# EAGLE board 519_jetson_nano_020100 (EAGLE 9.6.2)
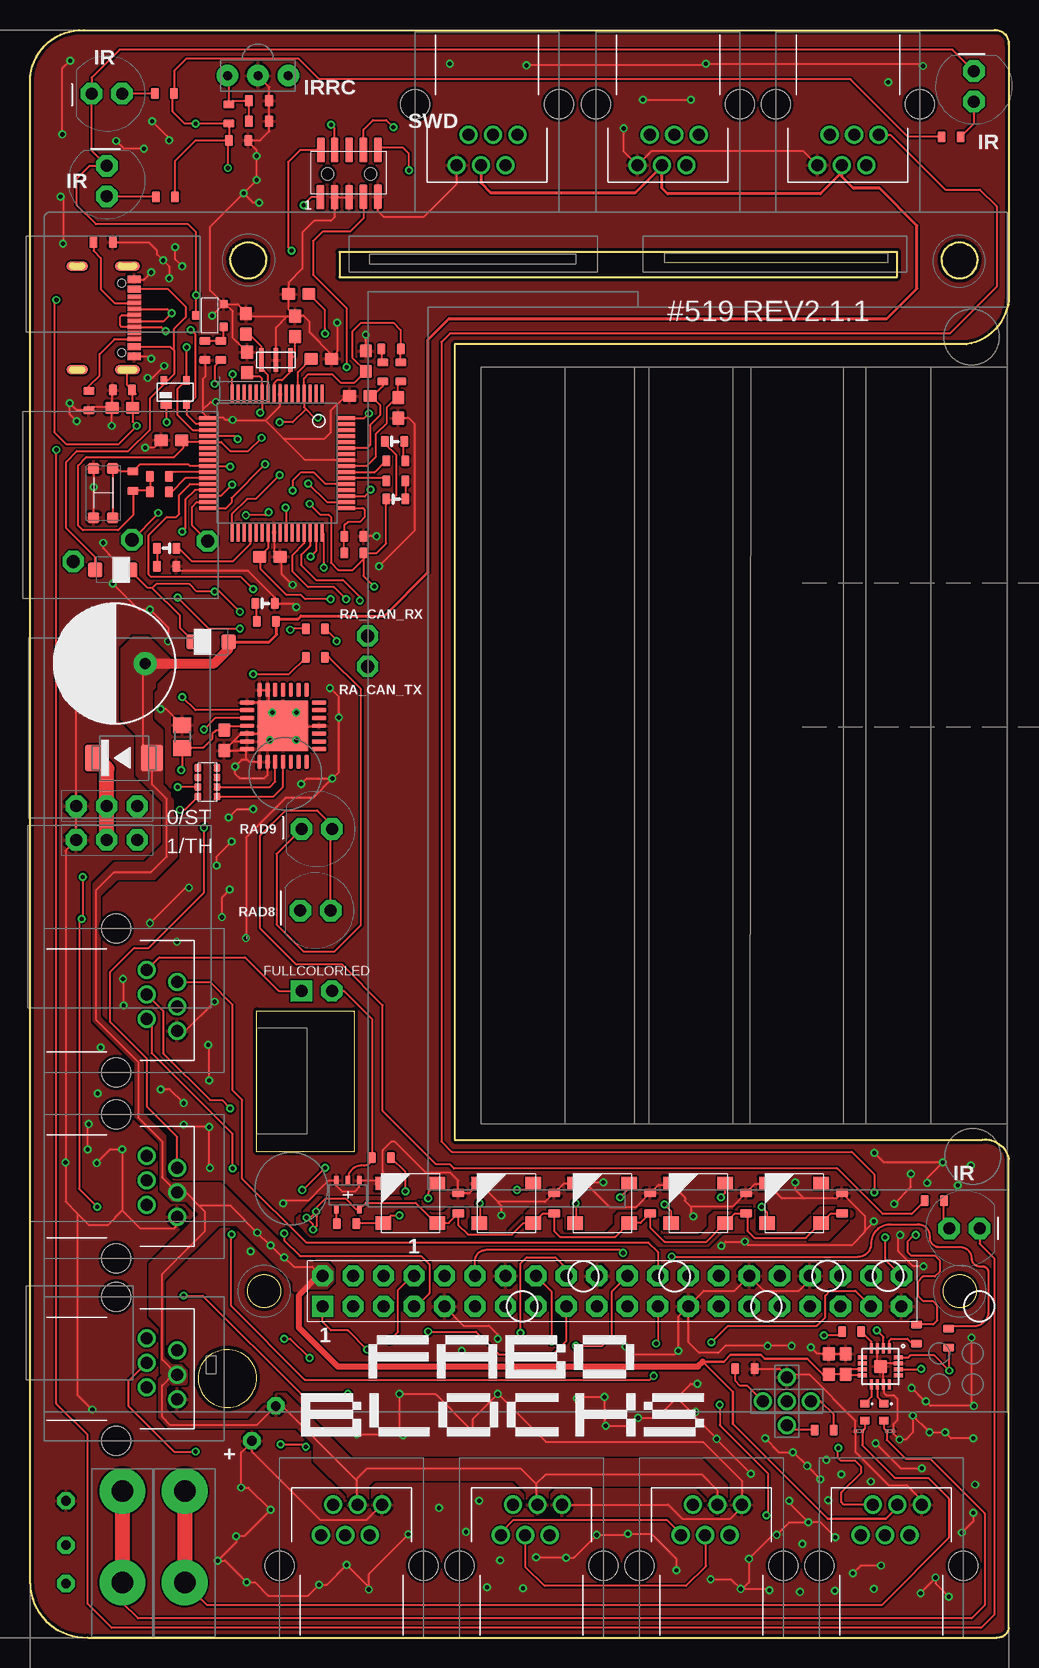
[diagram p5: board, top side]
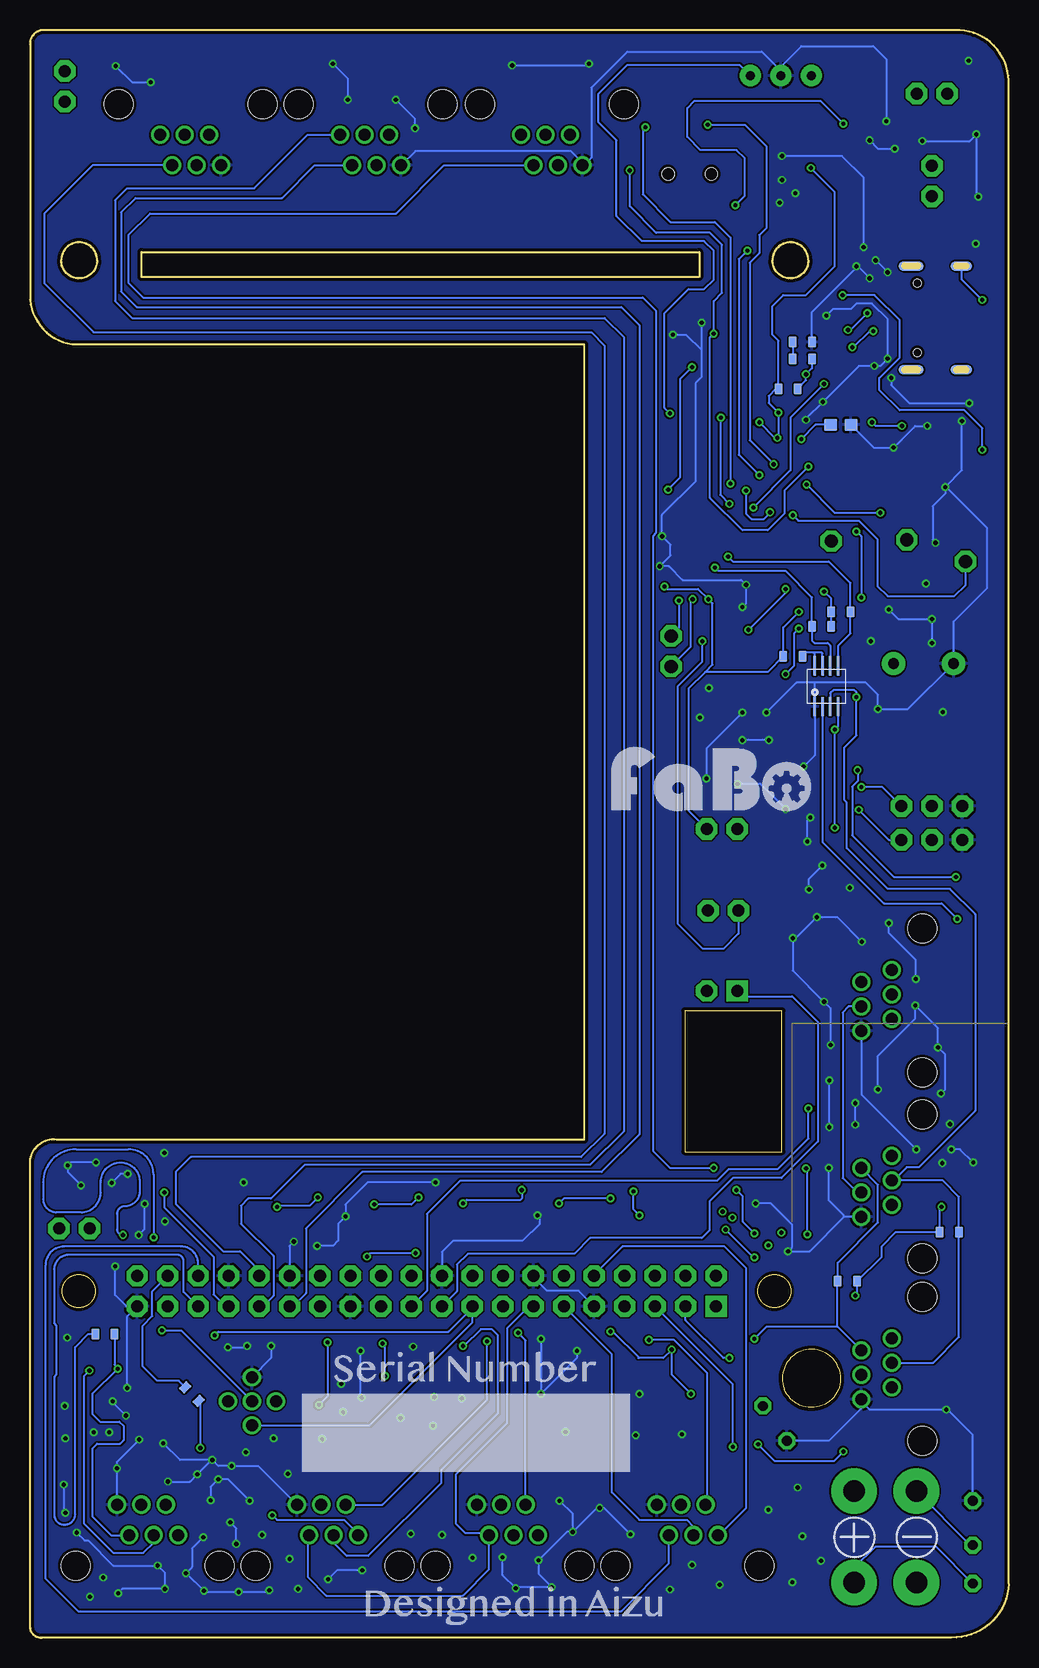
[diagram p6: board, bottom side, seen from below]

Size 81.6 x 134.01 mm. Coordinates in mm from the lower left corner, seen from the top.
Outline: 35.4,41.51 79.4,41.51 arc-84 81.6,39.91 81.6,0.81 arc-90 80.6,0.01 4.8,0.01 arc-90 0,4.51 0,129.81 arc-90 4.5,134.01 80.4,134.01 arc-96 81.6,132.81 81.6,111.51 arc-75 78.1,107.81 35.4,107.81 35.4,41.51
Outline: 16.7,114.81 arc-180 19.7,114.81 arc-180 16.7,114.81
Outline: 25.8,113.41 72.3,113.41 72.3,115.51 25.8,115.51 25.8,113.41
Outline: 76,114.81 arc-180 79,114.81 arc-180 76,114.81
Outline: 14.2,22.51 arc180 18.7,20.71 arc180 14.2,22.51
Outline: 18.9,40.51 18.9,52.26 27,52.26 27,40.51 18.9,40.51
Copper layers (1*16): Top 0.035mm / dielectric 1.6mm / Bottom 0.035mm
Design rules "PCBway": minimum track width 6mil, minimum drill 12mil, track to track 6mil, track to pad 6mil, pad to pad 6mil, via to via 6mil, smd to smd 6mil, copper to edge 10mil, drill to drill 10mil, minimum pad ring 10mil, minimum via ring 6mil, stop-mask expansion 2mil, vias tented up to drill 100mil, thermal gap 8mil
tKeepout: area 15.6,-0.5 to 18.6,14.1

## Footprints (pad centres in the part's own frame; a part is rotated, then mirrored left to right if it is on the bottom)
FABO_BRICK_3PIN_HEADER = drill 1 pad 1.778 octagon: GND -2.54,0; I/O 2.54,0; VCC 0,0
F13 = drill 0.9 pad 1.93: ANODE -2.5,0; CATHODE 2.5,0
0603-NARROW = smd 0.71 x 1: 1 -0.85,0; 2 0.85,0
0603 = smd 1.1 x 1: 1 -0.85,0; 2 0.85,0
PIN_1X1_SMALL = drill 0.8 pad 1.422 octagon: 1 0,0
PIN-HEADER-SMT(1.27MM)2X5 = smd 0.635 x 2.032: 1 -2.4,-1.95; 2 -2.35,2; 3 -1.2,-1.95; 4 -1.2,2; 5 0,-1.95; 6 0,2; 7 1.2,-1.9; 8 1.2,2; 9 2.4,-1.9; 10 2.4,2 | hole 1: 1.8,0; -1.8,0
SOD123W = smd 1.2 x 1.2: 1 -1.45,0; 2 1.45,0
SMBF = smd 1.85 x 2.2: ANODE 2.325,0; CATHODE -2.325,0
0603' = smd 0.65 x 0.9: 1 -0.8,0; 2 0.8,0
PIN_1X2 = drill 1 pad 1.778 square: 1 -1.27,0 | drill 1 pad 1.778 octagon: 2 1.27,0
7002-6PXC-X = drill 1: 1 2.55,5.08; 2 1.53,2.54; 3 0.51,5.08; 4 -0.51,2.54; 5 -1.53,5.08; 6 -2.55,2.54 | hole 2.4: -6,0; 6,0
8PIN-SSOP = smd 0.3 x 1.6: 1 -0.975,-1.7; 2 -0.325,-1.7; 3 0.325,-1.7; 4 0.975,-1.7; 5 0.975,1.7; 6 0.325,1.7; 7 -0.325,1.7; 8 -0.975,1.7
HVQFN28 = smd 1.2 x 0.38: 1:A3 -3,1.95; 2:A4 -3,1.3; 3:LED0 -3,0.65; 4:LED1 -3,0; 5:LED2 -3,-0.65; 6:LED3 -3,-1.3; 7:LED4 -3,-1.95; 15:LED11 3,-1.95; 16:LED12 3,-1.3; 17:LED13 3,-0.65; 18:LED14 3,0; 19:LED15 3,0.65; 20:OE 3,1.3; 21:A5 3,1.95 | smd 0.38 x 1.2: 8:LED5 -1.95,-3; 9:LED6 -1.3,-3; 10:LED7 -0.65,-3; 11:VSS 0,-3; 12:LED8 0.65,-3; 13:LED9 1.3,-3; 14:LED10 1.95,-3; 22:EXTCLK 1.95,3; 23:SCL 1.3,3; 24:SDA 0.65,3; 25:VDD 0,3; 26:A0 -0.65,3; 27:A1 -1.3,3; 28:A2 -1.95,3 | smd 4.25 x 4.25: 29 0,0
PIN_1X1_NOLABEL = drill 1.1 pad 1.778 octagon: 1 0,0
1608MM = smd 0.6 x 0.8: 1 -0.7,0; 2 0.7,0
WS2812B_NARROW = smd 1.3 x 1.1: 1-VDD -2.25,1.65; 2-DOUT -2.25,-1.65; 3-VSS 2.25,-1.65; 4-DIN 2.25,1.65
0603'' = smd 0.65 x 0.9: ANODE -0.8,0; CATHODE 0.8,0
LED_5MM = drill 1 pad 1.8 octagon: A -1.27,0; K 1.27,0
SUPERSOT-3 = smd 0.76 x 0.76: D 0,1.15; G -0.95,-1.15; S 0.95,-1.15
OSRB38C9AA = drill 0.75 pad 1.778: 1:OUT -2.54,0; 2:GND 0,0; 3:VCC 2.54,0
EXBV8V = smd 0.6 x 0.6: 1 -1.2,-0.8; 2 -0.4,-0.8; 3 0.4,-0.8; 4 1.2,-0.8; 5 1.2,0.8; 6 0.4,0.8; 7 -0.4,0.8; 8 -1.2,0.8
R0805 = smd 1.3 x 1.5: 1 -0.95,0; 2 0.95,0
3-SMD = smd 0.4 x 1.9: 1:INPUT 1.2,0; 2:GND 0,0; 3:OUTPUT -1.2,0
KMR2 = smd 0.9 x 1: 1 -2.05,0.8; 2 2.05,0.8; 3 2.05,-0.8; 4 -2.05,-0.8
TBL004-508 = drill 1.8 pad 3.81: P$1 0,3.81; P$2 0,-3.81
AVRF0X0X100LT_0603 = smd 0.25 x 0.3: 1 -0.275,0; 2 0.275,0
TQFN(16L3*3*0.75) = smd 0.28 x 0.8: 1 -0.75,-1.5; 2 -0.25,-1.5; 3 0.25,-1.5; 4 0.75,-1.5; 9 0.75,1.5; 10 0.25,1.5; 11 -0.25,1.5; 12 -0.75,1.5 | smd 0.8 x 0.28: 5 1.5,-0.75; 6 1.5,-0.25; 7 1.5,0.25; 8 1.5,0.75; 13 -1.5,0.75; 14 -1.5,0.25; 15 -1.5,-0.25; 16 -1.5,-0.75 | smd 1.1 x 1.1: 17 0,0
PINHEAD2MM_CROSS = drill 1: 1 0,0; 2 -2,0; 3 0,2; 4 2,0; 5 0,-2
LQFP-64_RENESAS = smd 0.28 x 1.5: 1:P400 -3.75,-5.75; 2:P401 -3.25,-5.75; 3:P402 -2.75,-5.75; 4:VBATT -2.25,-5.75; 5:VCL -1.75,-5.75; 6:P215/XCIN -1.25,-5.75; 7:P214/XCOUT -0.75,-5.75; 8:VSS -0.25,-5.75; 9:P213/XTAL 0.25,-5.75; 10:P212/EXTAL 0.75,-5.75; 11:VCC 1.25,-5.75; 12:P411 1.75,-5.75; 13:P410 2.25,-5.75; 14:P409 2.75,-5.75; 15:P408 3.25,-5.75; 16:P407 3.75,-5.75; 33:P108/TMS/SWDIO 3.75,5.75; 34:P109/TDO/SWO 3.25,5.75; 35:P110/TDI 2.75,5.75; 36:P111 2.25,5.75; 37:P112 1.75,5.75; 38:P113 1.25,5.75; 39:VCC 0.75,5.75; 40:VSS 0.25,5.75; 41:P107 -0.25,5.75; 42:P106 -0.75,5.75; 43:P105 -1.25,5.75; 44:P104 -1.75,5.75; 45:P103 -2.25,5.75; 46:P102 -2.75,5.75; 47:P101 -3.25,5.75; 48:P100 -3.75,5.75 | smd 1.5 x 0.28: 17:VSS_USB 5.75,-3.75; 18:P915/USB_DM 5.75,-3.25; 19:P914/USB_DP 5.75,-2.75; 20:VCC_USB 5.75,-2.25; 21:VCC_USB_LDO 5.75,-1.75; 22:P206 5.75,-1.25; 23:P205 5.75,-0.75; 24:P204 5.75,-0.25; 25:RES 5.75,0.25; 26:P201/MD 5.75,0.75; 27:P200 5.75,1.25; 28:P304 5.75,1.75; 29:P303 5.75,2.25; 30:P302 5.75,2.75; 31:P301 5.75,3.25; 32:P300/TCK/SWCLK 5.75,3.75; 49:P500 -5.75,3.75; 50:P501 -5.75,3.25; 51:P502 -5.75,2.75; 52:P015 -5.75,2.25; 53:P014 -5.75,1.75; 54:P013/VREFL -5.75,1.25; 55:P012/VREFH -5.75,0.75; 56:AVCC0 -5.75,0.25; 57:AVSS0 -5.75,-0.25; 58:P011/VREFL0 -5.75,-0.75; 59:P010/VREFH0 -5.75,-1.25; 60:P004 -5.75,-1.75; 61:P003 -5.75,-2.25; 62:P002 -5.75,-2.75; 63:P001 -5.75,-3.25; 64:P000 -5.75,-3.75
5077CR-16-SMC2-BK-TR = smd 0.6 x 1.14: A1,B12:GND -3.2,0; A4,B9:VBUS -2.4,0; B1,A12:GND 3.2,0; B4,A9:VBUS 2.4,0 | smd 0.3 x 1.14: A5:CC1 -1.25,0; A6:DP1 -0.25,0; A7:DN1 0.25,0; A8:SBU1 1.25,0; B5:CC2 1.75,0; B6:DP2 0.75,0; B7:DN2 -0.75,0; B8:SBU2 -1.75,0 | smd 0.8 x 2.1: SHILED1 -4.32,-0.57; SHILED2 4.32,-0.57 | smd 0.8 x 1.8: SHILED3 -4.32,-4.75; SHILED4 4.32,-4.75 | smd 0.8 x 2.1 bottom: SHILED5 -4.32,-0.57; SHILED7 4.32,-0.57 | smd 0.8 x 1.8 bottom: SHILED6 -4.32,-4.75; SHILED8 4.32,-4.75 | hole 0.65: -2.89,-1.07; 2.89,-1.07
SOT143B = smd 1 x 0.7: 1 -0.75,-1 | smd 0.6 x 0.7: 2 0.95,-1; 3 0.95,1; 4 -0.95,1
TSOP5(SOT753) = smd 0.7 x 0.45: 1 1.2,-0.95; 2 1.2,0; 3 1.2,0.95; 4 -1.2,0.95; 5 -1.2,-0.95
JETSON_NANO_DEMENTION = drill 1 pad 1.778 square: 1 0,0 | drill 1 pad 1.778 octagon: 2 0,2.54; 3 2.54,0; 4 2.54,2.54; 5 5.08,0; 6 5.08,2.54; 7 7.62,0; 8 7.62,2.54; 9 10.16,0; 10 10.16,2.54; 11 12.7,0; 12 12.7,2.54; 13 15.24,0; 14 15.24,2.54; 15 17.78,0; 16 17.78,2.54; 17 20.32,0; 18 20.32,2.54; 19 22.86,0; 20 22.86,2.54; 21 25.4,0; 22 25.4,2.54; 23 27.94,0; 24 27.94,2.54; 25 30.48,0; 26 30.48,2.54; 27 33.02,0; 28 33.02,2.54; 29 35.56,0; 30 35.56,2.54; 31 38.1,0; 32 38.1,2.54; 33 40.64,0; 34 40.64,2.54; 35 43.18,0; 36 43.18,2.54; 37 45.72,0; 38 45.72,2.54; 39 48.26,0; 40 48.26,2.54

## Placement (x,y rotation side)
0/ST  [FABO_BRICK_3PIN_HEADER]  6.4,69.31 0 top
1/TH  [FABO_BRICK_3PIN_HEADER]  6.4,66.51 0 top
A1  [F13]  7.1,81.21 180 top
C1  0.1uF  [0603-NARROW]  59.7,36.21 270 top
C2  0.1uF  [0603-NARROW]  51.7,36.21 270 top
C3  0.1uF  [0603-NARROW]  43.7,36.21 270 top
C4  0.1uF  [0603-NARROW]  35.7,36.21 270 top
C5  0.1uF  [0603-NARROW]  67.7,36.21 270 top
C6  0.1uF  [0603]  68,22.81 270 top
C7  0.1uF  [0603]  30.7,102.51 90 top
C8  10uF  [0603]  66.6,22.81 270 top
C9  15pF  [0603]  22.1,109.31 270 top
C10  1uF  [0603]  27.5,103.51 0 top
C11  4.7uF  [0603]  24.3,106.61 180 top
C12  4.7uF  [0603]  18.1,106.31 270 top
C13  0.1uF  [0603]  20,90.11 180 top
C14  0.1uF  [0603]  11.8,99.81 0 top
C15  0.1uF  [0603]  16.2,74.81 90 top
C16  DNP  [0603]  22.4,112.01 0 top
C17  4.7uF 1KV  [0603]  7.7,102.51 0 top
C18  4.7uF  [0603]  14,101.11 180 bottom
C19  0.1uF  [0603]  28,106.41 270 top
C20  15pF  [0603]  18,109.51 270 top
C21  47uF  [0603-NARROW]  19.1,126.41 180 top
C22  47uF  [0603-NARROW]  19.1,128.11 180 top
CN1  [PIN_1X1_SMALL]  18.5,16.41 0 top
CN2  [PIN_1X1_SMALL]  3,11.41 0 top
CN3  [PIN_1X1_SMALL]  20.5,19.31 0 top
CN4  [PIN_1X1_SMALL]  3,4.51 0 top
CN5  [PIN_1X1_SMALL]  3,7.71 0 top
CN6  [PIN-HEADER-SMT(1.27MM)2X5]  26.6,122.01 0 top
D1  PMEG6020AELR  [SOD123W]  15.1,83.01 0 top
D3  SR54F  [SMBF]  7.85,73.31 0 top
D24  PMEG6020AELR  [SOD123W]  6.9,89.01 180 top
FB1  [0603']  29.4,105.51 270 top
FB2  [0603']  30.9,105.51 270 top
FULLCOLORLED  [PIN_1X2]  23.9,53.91 0 top
GPIO4  MODULAR-JACK-6P-RJ11_GPIO3  [7002-6PXC-X]  38.1,127.81 180 top
GPIO5,6  MODULAR-JACK-6P-RJ11_GPIO3  [7002-6PXC-X]  53.2,127.81 180 top
I2C  MODULAR-JACK-6P-RJ11_I2C  [7002-6PXC-X]  7.2,37.61 270 top
I2C1  MODULAR-JACK-6P-RJ11_I2C  [7002-6PXC-X]  7.2,22.41 270 top
I2S0(DAP4)1  MODULAR-JACK-6P-RJ11_I2S_MASTER  [7002-6PXC-X]  71.8,6.01 0 top
IC1  [8PIN-SSOP]  15.2,79.31 0 bottom
IC2  [HVQFN28]  21.1,76.01 90 top
JETSON_PWM  MODULAR-JACK-6P-RJ11_GPIO3  [7002-6PXC-X]  68.2,127.81 180 top
JP1  [PIN_1X1_NOLABEL]  28.15,83.5 0 top
JP2  [PIN_1X1_NOLABEL]  28.15,80.96 0 top
JP3  [PIN_1X1_NOLABEL]  14.8,91.41 0 top
JP4  [PIN_1X1_NOLABEL]  8.5,91.51 0 top
JP5  [PIN_1X1_NOLABEL]  3.6,89.71 0 top
L1  MAF1608F  [1608MM]  69.6,18.81 270 top
L2  MAF1608F  [1608MM]  71.2,18.81 270 top
LED0  [WS2812B_NARROW]  31.7,36.21 180 top
LED1  [WS2812B_NARROW]  39.7,36.21 180 top
LED2  [WS2812B_NARROW]  47.7,36.21 180 top
LED3  [WS2812B_NARROW]  55.7,36.21 180 top
LED4  [WS2812B_NARROW]  63.7,36.21 180 top
LED5  [0603'']  19.6,86.21 0 top
LED6  IR  [LED_5MM]  6.4,128.71 180 top
LED7  [LED_5MM]  6.4,121.41 90 top
LED8  [LED_5MM]  77.9,34.11 0 top
LED9  [LED_5MM]  78.7,129.31 90 top
LED10  [0603'']  11.4,90.81 180 top
LED11  [0603'']  30.4,99.71 0 top
LED12  [0603'']  30.5,94.91 0 top
M1  MOSFET-N_FDN335N  [SUPERSOT-3]  15,110.21 90 top
M2  OSRB38C9AA  [OSRB38C9AA]  19,130.21 180 top
R1  180  [0603']  11.2,128.71 0 top
R2  180  [0603']  11.3,120.11 0 top
R3  180  [0603']  75.4,36.41 180 top
R4  180  [0603']  76.8,125.11 180 top
R5  22  [0603']  68.1,20.31 135 bottom
R6  634K  [0603']  68.5,25.51 0 top
R7  220  [EXBV8V]  14.8,71.31 90 top
R8  510(1/4W)  [R0805]  12.7,75.11 270 top
R9  0  [0603']  26.4,34.51 180 top
R10  22  [0603']  73.9,25.31 90 top
R11  220  [0603']  23.8,84.11 0 top
R12  220  [0603']  23.8,81.71 0 top
R13  220  [0603']  15.9,107.31 90 top
R14  10K  [0603']  14.6,107.31 270 top
R15  5.1K  [0603']  30.1,107.41 0 top
R16  5.1K  [0603']  10.8,95.51 0 top
R17  100K  [0603']  66.2,17.31 0 top
R18  100K  [0603']  59.6,22.41 0 top
R19  5.1K  [0603']  10.8,96.81 0 top
R20  5.1K  [0603']  18.4,104.11 0 bottom
R21  1K  [0603']  19.7,84.71 0 top
R22  10K  [0603']  4.95,33.81 180 bottom
R23  10K  [0603']  13.45,29.71 0 bottom
R24  5.1K  [0603']  17.2,106.61 180 bottom
R25  5.1K  [0603']  17.2,108.01 0 bottom
R26  100K1%  [0603']  27,90.41 180 top
R27  13.7K1%  [0603']  27,91.81 0 top
R28  5.1K  [0603']  8.6,96.41 90 top
R29  5.1K  [0603']  7.7,104.01 180 top
R30  5.1K  [0603']  4.9,103.11 270 top
R31  5.1K  [0603']  6.1,116.31 0 top
R32  330  [0603']  11.4,89.31 0 top
R33  330  [0603']  30.5,98.11 180 top
R34  330  [0603']  30.5,96.41 180 top
R35  200K  [0603']  18,81.81 0 bottom
R36  5.1K  [0603']  15.6,84.31 180 bottom
R37  5.1K  [0603']  14,85.51 0 bottom
R38  22  [0603']  75.35,25.31 0 bottom
R39  22  [0603']  76.6,24.96 90 top
R43  22K  [0603']  16.6,127.01 90 top
R44  51K  [0603']  17.4,124.81 0 top
R45  DNF  [0603']  29.3,40.01 180 top
RAD8  RA_D8  [LED_5MM]  23.8,60.61 180 top
RAD9  RA_D9  [LED_5MM]  23.9,67.41 180 top
RS  CSTNE16M0V53L00ZR0  [3-SMD]  20.5,106.51 0 top
SPI1-0  MODULAR-JACK-6P-RJ11_SPI  [7002-6PXC-X]  7.2,53.11 270 top
SPI2-0  MODULAR-JACK-6P-RJ11_SPI  [7002-6PXC-X]  41.8,6.01 0 top
SPI2-1  MODULAR-JACK-6P-RJ11_SPI  [7002-6PXC-X]  56.8,6.01 0 top
SW1  [KMR2]  6.1,95.41 270 top
T3  [TBL004-508]  12.9,8.41 0 top
T4  [TBL004-508]  7.7,8.41 0 top
U$11  AVRF060X100LT242  [AVRF0X0X100LT_0603]  69.1,17.21 180 top
U$12  AVRF060X100LT242  [AVRF0X0X100LT_0603]  71.7,17.21 0 top
U$13  MAX98357A,B  [TQFN(16L3*3*0.75)]  70.9,22.61 180 top
U$14  2MMJUMPER_CROSS  [PINHEAD2MM_CROSS]  63.1,19.71 180 top
U$17  [LOGO_FABO_L]  25.5,68.91 0 bottom
U$19  R7FA4M1AB3CFM  [LQFP-64_RENESAS]  20.6,97.91 180 top
U$22  5077CR-16-SMC2-BK-TR  [5077CR-16-SMC2-BK-TR]  8.7,110.01 270 top
U$23  PRTR5V0U2X  [SOT143B]  12.1,103.81 0 top
U$28  74LVC1G125  [TSOP5(SOT753)]  26.5,36.91 90 top
U$32  JETSON_NANOJETSON_NANO_OVERALL  [JETSON_NANO_DEMENTION]  24.4,27.61 0 top
UART2  MODULAR-JACK-6P-RJ11_SERIAL_M_USART  [7002-6PXC-X]  26.8,6.01 0 top

## Tracks (layer width: path | path; a pad name or v marks a point on that pad's centre or on a via)
3DB
  Top 0.152: R17.2 67,18.61 65.9,19.71 U$14.2
5V  (via drill 0.35)
  Top 0.152: R44.1 R43.1 v13.8,126.21 12.9,126.21 11.9,127.21 11.9,128.61 R1.2 12,130.61 13,131.61 22.4,131.61 24.1,129.91 68.4,129.91 73.2,125.11 R4.2 | R2.2 12.1,123.11 13.8,124.81 R44.1 | v17.5,85.51 15.7,87.31 15.5,87.31 v15.4,87.21 13.9,87.21 13.3,87.81 10.5,87.81 10.2,87.51 | R28.1 8.85,95.36 | CN6.1 23.45,120.06 v22.8,119.41 | v25.05,86.56 22.95,86.56 22.6,86.91 21.4,86.91 19.23,89.08 19.23,90.18 | R26.1 28.9,90.41 29.7,91.21 29.7,94.81 | 29.7,94.81 LED12.ANODE | D1.1 12.5,84.16 12.5,85.21 10.2,87.51 | 10.2,87.51 9.8,87.51 8.35,88.96 D24.1 | C12.2 18.45,105.11 19.2,105.11 19.35,104.96 U$19.11:VCC 19.35,102.26 v19.2,102.11 | U$19.39:VCC 19.85,90.81 19.23,90.18 | 19.23,90.18 C13.2 | 12.8,99.66 U$19.21:VCC_USB_LDO 15.95,99.66 16.7,98.91 18.2,98.91 v19.3,100.01 | 12.8,99.66 C14.2 | R19.1 R16.1 9.9,95.61 R28.1 | R28.1 8.6,93.56 7.35,92.31 4.4,92.31 4,92.71 4,97.71 4.7,98.41 12,98.41 12.8,99.21 12.8,99.66 | v16.5,122.51 16.5,124.71 R44.1 | v24,101.71 23.7,101.71 23,102.41 | v23.3,94.51 24.2,93.61 24.9,93.61 25.1,93.41 25.1,89.61 25.7,89.01 26.9,89.01 27.8,89.91 R26.1 | 23,102.41 22.85,102.56 U$19.4:VBATT 22.85,104.96 23.2,105.31 25.2,105.31 25.9,104.61 27.05,104.61 C19.2 26.91,106.65 26.91,108.91 27.6,109.61 30.3,109.61 30.9,109.01 30.9,107.51 31,107.41 R15.2 FB2.1 | 23,102.41 21.9,101.31 v20.8,101.31 | R3.2 73.5,35.31 71.1,35.31 67.3,39.11 35.35,39.11 35,39.46 33.85,39.46 29.4,43.91 29.4,52.71 26,56.11 22.2,56.11 19.2,59.11 19.2,66.86 21.3,68.96 23.95,68.96 25.07,67.84 25.07,67.31 | RAD8.A 25.07,67.31 | 25.07,67.31 RAD9.A | LED11.ANODE 29.6,99.51 30.5,98.61 30.5,95.21 30.1,94.81 29.7,94.81
  Top 0.152: R26.1 27.8,88.51 v28.7,87.61
  Bottom 0.152: R36.1 R37.1 14.8,86.61 v15.4,87.21 | v17.5,85.51 18.8,84.21 R35.1 20.1,80.51 25.3,80.51 | v22.8,119.41 22,120.21 22,123.31 22.7,124.01 25.7,124.01 26.8,125.11 26.8,127.51 26.2,128.11 15.7,128.11 v13.8,126.21 | v16.5,122.51 14.5,120.51 14.5,114.31 16.9,111.91 18.8,111.91 19.7,111.01 19.7,108.61 19.2,108.11 R20.1 19.4,104.11 20,103.51 20,102.91 v19.2,102.11 19.2,100.11 v19.3,100.01 19.25,99.96 19.45,99.96 v20.8,101.31 | v24,101.71 24.06,101.65 24.06,95.26 v23.3,94.51 | 25.3,80.51 26.7,79.11 26.7,68.94 RAD9.A | 25.3,80.51 24.7,81.11 24.7,86.21 v25.05,86.56 25.9,87.41 28.5,87.41 v28.7,87.61
15DB
  Top 0.152: U$14.4 59.8,21.01 59.2,21.01 58.8,21.41 R18.1
AREF
  Top 0.152: R15.1 29.3,106.41 FB1.1
CAN0_RX  (via drill 0.35)
  Top 0.152: U$19.46:P102 23.35,91.01 22.6,90.26 22.6,89.41 23.85,88.16 26.1,88.16 27.5,86.76 v27.5,86.45
  Bottom 0.152: JP1.1 27.5,84.15 v27.5,86.45
CAN0_TX  (via drill 0.35)
  Top 0.152: v26.35,86.56 25.35,87.56 23.2,87.56 21.9,88.86 21.9,90.25 22.87,91.22 22.87,92.14 U$19.45:P103
  Bottom 0.152: JP2.1 26.5,82.61 26.5,86.41 v26.35,86.56
DAC  (via drill 0.35)
  Top 0.152: U$19.53:P014 24.65,96.16 23.7,97.11 22.55,97.11 21.9,96.46 v21.9,95.61 | v19.9,93.81 19.65,93.56 v18,93.56
  Bottom 0.152: v21.9,95.61 21.9,93.71 21.45,93.26 20.4,93.26 19.9,93.76 v19.9,93.81 | v18,93.56 17.55,93.11 12.5,93.11 10.95,91.56 10.95,87.66 10.1,86.81 4.55,86.81 3.6,87.76 JP5.1
GAIN  (via drill 0.35)
  Top 0.152: U$13.2 71.15,25.06 v70.6,25.61
  Bottom 0.152: v70.6,25.61 69,25.61 U$14.1
GND  (via drill 0.35)
  Top 0.152: 63.15,21.76 63.3,21.91 65,21.91 68.83,18.08 U$11.2 68.83,15.48 71.6,12.71 73.1,12.71 74.35,11.46 I2S0(DAP4)1.1 | 63.15,21.76 U$14.5 | R18.2 62.5,22.41 63.15,21.76 | C6.1 C8.1 65.65,23.66 v65.1,24.21 | SPI2-0.1 53.22,11.09 54.4,9.91 58.4,9.91 59.35,10.86 SPI2-1.1 59.35,13.06 56.1,16.31 43,16.31 v39,20.31 36.95,18.26 v36.95,17.16 33.8,20.31 v30.8,20.31 30.8,17.16 v31.1,16.86 31,16.96 v27.25,16.96 | 70.65,22.91 70.65,22.86 U$13.17 71.15,22.36 U$13.11 71.2,21.06 71.2,20.41 71.4,20.21 72,20.21 72.3,19.91 72.3,18.11 71.97,17.78 U$12.2 71.97,17.03 v72.5,16.51 73,16.51 73.6,17.11 v73.6,18.51 v75,17.11 v76.3,17.11 76.8,16.61 v78.65,16.61 | 70.65,22.91 U$13.3 | U$13.15 70.7,22.86 70.65,22.91 | v73.5,20.81 74.6,19.71 v74.7,19.71 75.1,19.31 v78.7,19.31 78.5,19.51 v78.5,25.01 | v63.5,24.31 v61.5,24.31 57.97,24.31 57.38,23.72 55.78,23.72 54.88,24.63 U$32.25 | 18.5,16.31 18.5,15.51 24.2,9.81 28.07,9.81 UART2.1 | 18.5,16.31 CN1.1 | R44.2 18.2,125.01 | R14.2 14.6,105.11 14.4,104.91 14.4,102.36 | 14.4,102.36 14.4,102.11 U$19.17:VSS_USB 14.9,101.71 16.1,101.71 16.3,101.51 v16.9,101.51 19.7,101.51 | C20.1 18.1,110.36 | C9.1 18.3,110.16 18.1,110.36 | M1.S 16.3,111.16 | 16.3,111.16 17.3,111.16 18.1,110.36 | RS.2:GND 20.5,109.21 21.45,110.16 C9.1 | 6.85,102.61 C17.1 6.8,102.46 v6.8,101.01 | 6.85,102.61 6.85,103.96 R29.2 | 6.85,102.61 5.2,102.61 R30.2 3.9,102.31 v3.3,102.91 3.3,102.01 v3.9,101.41 | R31.2 9.9,116.31 10.6,115.61 10.6,115.31 v11.1,114.81 11.6,114.31 v11.6,113.31 | U$22.B1,A12:GND 9.9,106.81 v10.1,106.61 | v11.2,106.01 10.2,105.01 v9.8,105.01 | U$22.A1,B12:GND 9.5,113.21 v10.1,113.81
  Top 0.152: 12.8,114.21 v12.7,114.31 12.1,114.91 v12.1,115.91 | R44.2 18.2,124.71 18.9,124.01 v18.9,123.51 v18.9,121.51 v17.8,120.41 | SW1.4 v5.3,95.91 SW1.3 | C9.1 21.55,110.71 C16.1 21.55,112.96 22.7,114.11 22.7,117.11 23.7,118.11 25.1,118.11 25.4,118.41 CN6.3 CN6.5 | v28.9,91.81 R27.2 | 21.2,99.91 24.5,99.91 25.1,100.51 25.1,102.31 26.3,103.51 C10.1 | 21.2,99.91 19.65,101.46 19.7,101.51 | U$19.8:VSS 20.85,102.66 19.7,101.51 | 18.02,73.98 18,73.96 C15.1 17.05,74.81 | 18.02,73.98 IC2.28:A2 | IC2.1:A3 18.3,73.01 18.1,73.21 | 18.02,73.98 18.02,73.28 18.1,73.21 | 21.8,75.91 21.8,75.41 21.75,75.36 IC2.26:A0 18.05,75.41 17.65,75.41 17.05,74.81 | 21.8,75.91 21.8,76.21 20.05,77.96 19.9,77.96 | 19.9,77.96 IC2.22:EXTCLK | 19.9,77.96 19.9,78.91 IC2.20:OE IC2.21:A5 | IC2.11:VSS 24,75.91 21.8,75.91 | A1.CATHODE 3.86,80.47 0/ST.GND 1/TH.GND 2.96,65.61 v2.96,39.61 2.96,36.35 3.95,35.36 | C11.1 25.15,106.71 | 25.15,106.71 25.15,106.96 23.3,108.81 23.3,109.71 22.8,110.21 22.15,110.21 C9.1 | C12.1 16.9,108.36 16.9,110.56 16.3,111.16 | U$19.40:VSS 20.35,90.61 C13.1 20.95,90.01 20.95,88.71 v21.9,87.76 | R32.2 12.6,88.91 18.2,88.91 20.4,86.71 LED5.CATHODE 21.9,86.21 v22.2,85.91 | C14.1 10.35,99.21 v9.6,99.21 | v19.1,119.61 18.6,119.61 v17.8,120.41 | U$19.57:AVSS0 22.95,98.16 21.2,99.91 | GPIO4.1 35.55,121.16 32.8,118.41 29.5,118.41 29,118.91 CN6.9 | v25.6,109.61 25.6,107.16 25.15,106.71 | v70.5,16.21 72.6,14.11 v74.35,14.11 | R8.1 11.35,77.41 v10.9,77.41 | 39,36.31 LED1.3-VSS 36.65,37.06 C4.1 35.7,38.11 35.05,38.76 33,38.76 30.45,41.31 30.1,41.31 29.4,40.61 29.4,38.91 29.45,38.86 LED0.3-VSS 29.2,38.11 U$28.1 27.45,37.56 27.1,37.21 26,37.21 25.55,37.66 U$28.3 24.9,38.11 23.2,36.41 21.3,36.41 v21.1,36.21
  Top 0.152: 39,36.31 42.95,36.31 C3.1 44.5,37.86 LED2.3-VSS 46.35,37.86 | 7.7,35.61 v7.7,40.71 6.7,40.71 v5.55,39.56 | I2C.1 12.28,34.39 12,34.11 9.2,34.11 7.7,35.61 | 3.95,35.36 4.9,34.41 6.5,34.41 7.7,35.61 | 3.95,35.36 3.95,20.26 v5.2,19.01 | C19.1 v28,108.61 | 61.5,37.81 62.7,36.61 64.5,36.61 | 61.5,37.81 LED4.3-VSS | 64.5,36.61 67.25,36.61 C5.1 69.6,35.16 69.6,33.91 | 61.5,37.81 60.45,37.81 C1.1 58.55,35.91 55.1,35.91 | 46.35,37.86 48.3,35.91 50.55,35.91 C2.1 52.4,37.76 53.55,37.76 LED3.3-VSS 54.6,36.71 54.6,36.41 55.1,35.91 | 69.6,33.91 69.6,33.81 68.5,32.71 59.9,32.71 v59.6,33.01 58,33.01 v57.65,32.66 | v39.3,35.21 39.3,36.01 39,36.31 | JETSON_PWM.1 64.47,123.91 51.83,123.91 GPIO5,6.1 49.5,123.88 v49.5,125.81 | M1.S 15,112.31 15,117.61 v17.8,120.41 | IC2.27:A1 17.05,74.71 17.05,74.81 | v15.2,110.21 M1.S | IC2.2:A4 19.8,71.91 19.5,71.61 17.5,71.61 17.1,72.01 v17.1,72.61 17.7,73.21 18.1,73.21 | v20.2,77.11 20.2,76.91 IC2.29 20,74.91 v20,74.81 | v22.2,74.81 v22.2,77.11 | v25.2,71.61 23.6,70.01 21.3,70.01 18,66.71 v18,58.31 | v15.4,53.01 12.95,50.56 SPI1-0.1 | v65.9,13.21 v64.8,14.31 63.65,15.46 v63.6,15.46 62.45,15.46 v61.3,16.61 | M2.2:GND 19.95,129.26 C22.1 C21.1 19.95,125.56 19.2,124.81 R44.2 | C7.1 31.6,101.66 32.1,101.16 32.1,92.31 v29.1,89.31 | U$32.25 56.18,28.91 58.72,28.91 U$32.30 61.2,28.91 64.1,28.91 65.04,29.85 U$32.34 | U$32.9 36.16,26.01 38.25,26.01 39,25.26 v39,24.91 | v42.2,6.71 44.65,6.71 v44.7,6.66 45.35,6.66 v47.25,8.56 49.75,8.56 v49.85,8.66 51.8,8.66 53.9,6.56 v53.9,5.61 | v56.75,4.86 58.45,4.86 v59.25,4.06 59.4,4.06 | 59.4,4.06 61.55,4.06 v61.65,3.96
  Top 0.152: 59.4,4.06 59.95,4.61 v59.95,6.56 61.95,8.56 v62.25,8.56 63.3,9.61 v64.9,9.61 | v64.9,9.61 63.3,11.21 v63.3,11.41 | v78.65,10.41 78.65,9.71 v77.7,8.76 | v70.95,6.01 69.25,6.01 v68.6,5.36 | v67.15,8.36 65.9,9.61 v64.9,9.61 | v45.6,19.96 45.7,20.06 v47.9,20.06 47.9,17.76 v48,17.66 50.05,17.66 v50.7,18.31 52.25,18.31 53.92,19.98 | 53.92,19.98 v53.95,20.01 55.1,21.16 v55.65,21.16 | v49.65,24.26 50.3,23.61 53.75,23.61 v54.05,23.91 54.05,26.78 U$32.25 | 53.92,19.98 55.1,18.81 v55.5,18.81 55.5,18.31 v57.25,16.56 57.25,16.51 v60.1,13.66 | v74.25,3.71 74.25,3.76 v75.5,5.01 75.5,4.51 v76.6,3.41 | 18.5,16.31 17.6,15.41 v17.6,12.51 18.2,12.51 v20.05,10.66 17.85,8.46 v17.2,8.46 17.2,7.96 v15.65,6.41 16.25,6.41 v18.05,4.61 18.75,4.61 19.85,3.51 23.2,3.51 v24.1,4.41 24.75,4.41 v26.4,6.06 28.25,4.21 v28.25,4.01 28.25,5.31 v31.55,8.61 | 69.6,33.91 70.35,34.66 v70.35,34.71 | 55.1,35.91 55.1,35.31 v55.3,35.11 | 46.35,37.86 46.45,37.96 v47.8,37.96 | 64.5,36.61 63.8,37.31 v63.8,37.96 | v22.6,71.16 23.05,71.61 v25.2,71.61 | v25.2,71.61 25.75,72.16 v25.75,76.71 25.75,78.41 v25,79.16 | v10.2,126.41 11.6,125.01 v11.6,124.81 | v9.5,124.11 7.85,124.11 v7.2,124.76 | v2.7,125.31 2.7,130.81 v3.35,131.46 | v2.55,120.11 2.75,119.91 v2.75,116.21 | v16,60.06 16,61.71 v16.65,62.36 | v15.55,64.36 15.55,65.11 v16.8,66.36 | v16.55,68.36 17.25,69.06 v18.6,69.06 | v15,39.16 14.95,39.21 v14.95,42.56 13,42.56 v12.8,42.76 | v14.95,46.46 14.95,49.31 v14.85,49.41 | v12.8,44.56 11.65,45.71 v10.9,45.71 | v7.8,52.71 7.8,54.86 v7.75,54.91 | v10,59.56 12.95,62.51 v13.25,62.51 | v51.1,128.21 v55.1,128.21 | v74.45,131.01 74.25,131.21 v56.35,131.21 56.2,131.06 v41.4,131.06
  Top 0.152: v6.1,91.26 6.1,90.81 6.9,90.01 v6.9,87.86 9.05,85.71 v10,85.71 11.5,84.21 v11.5,83.06 | v6.4,82.91 6.4,78.06 v5.5,77.16 | 14.4,102.36 15.05,103.01 v15.5,103.01 | v74.5,30.96 73.65,30.96 72.4,32.21 72.4,33.41 v72.55,33.56 | v72.05,36.16 73.45,37.56 v73.45,38.66 | v70.4,40.41 71.2,39.61 v76.1,39.61 74.8,38.31 v74.8,37.91 | v4.8,40.71 4.8,42.71 v4.9,42.81
  Bottom 0.152: I2S0(DAP4)1.1 v74.35,14.11 74.35,14.66 v72.5,16.51 | v73.5,20.81 73.5,26.77 U$32.39 73.55,27.61 74.5,28.56 v74.5,30.96 | v74.7,19.71 74.7,19.61 v73.6,18.51 | v65.1,24.21 63.6,24.21 v63.5,24.31 | v61.5,24.31 61.5,23.31 U$14.5 | v16.9,101.51 16.9,101.61 v15.5,103.01 12.5,106.01 v11.2,106.01 10.7,106.01 v10.1,106.61 10.1,109.91 11.4,111.21 12.7,111.21 13.15,110.76 14.65,110.76 v15.2,110.21 | v10.1,113.81 v11.1,114.81 | v11.6,113.31 12.6,114.31 v12.7,114.31 12.7,114.21 16.4,110.51 R25.2 | v9.8,105.01 9.8,104.41 8.3,102.91 v3.3,102.91 | 5.25,95.96 v5.3,95.91 5.3,95.36 6.35,94.31 6.35,91.51 v6.1,91.26 | 5.25,95.96 3.9,97.31 v3.9,101.41 | v17.1,72.61 16.18,73.53 IC1.1 16.18,79.58 16.2,79.61 | v6.8,101.01 7.8,101.01 v9.6,99.21 11.25,99.21 C18.1 | v12.1,115.91 12.1,121.71 13.9,123.51 v18.9,123.51 | 25.6,107.31 25.6,105.11 26.1,104.61 26.1,96.41 28.9,93.61 v28.9,91.81 28.2,91.11 28.2,90.21 v29.1,89.31 28.35,89.31 27.2,88.16 22.3,88.16 v21.9,87.76 21.9,86.21 v22.2,85.91 | 25.6,107.31 v25.6,109.61 | v66.4,14.81 65.9,14.31 v64.8,14.31 62.57,14.31 SPI2-1.1 | v66.4,14.81 69.1,14.81 v70.5,16.21 | 16.2,79.61 11.9,79.61 10.9,78.61 v10.9,77.41 8.4,77.41 A1.CATHODE 4.6,84.71 1.8,87.51 1.8,92.51 5.25,95.96 | 16.2,79.61 17.7,79.61 v20.2,77.11 | I2C1.1 12.28,19.71 | 12.28,19.71 12.28,19.13 15,16.41 CN1.1 | CN2.1 3,16.91 5.1,19.01 v5.2,19.01 11.58,19.01 12.28,19.71 | I2C.1 13.75,35.06 | 13.75,35.06 16.6,32.21 v18.4,32.21 18.1,32.51 18.1,34.46 19.85,36.21 v21.1,36.21 | SPI1-0.1 12.28,45.29 v7.7,40.71 | v28,108.61 26.9,108.61 25.6,107.31 | v59.6,33.01 59.96,32.65 U$32.30 | v39.3,35.21 39.1,35.01 39.1,34.51 40.5,33.11 46.3,33.11 47.26,32.15 U$32.20
  Bottom 0.152: 35.55,122.91 35.55,122.96 36.5,123.91 49.47,123.91 GPIO5,6.1 | 35.55,122.91 GPIO4.1 | v20,74.81 v22.2,74.81 | v22.2,77.11 25.2,74.11 v25.2,71.61 | U$32.9 35.86,28.91 38.5,28.91 39.64,30.05 U$32.14 | v39,24.91 v39,20.31 36,23.31 v36,23.91 | 35.55,122.91 35.27,122.91 34.8,123.38 34.8,129.21 31.8,132.21 20.6,132.21 19,130.61 M2.2:GND 19,130.96 17.3,132.66 11.3,132.66 10.2,131.56 v10.2,126.41 | v31.55,8.61 33.75,10.81 v34.1,10.81 34.35,10.81 v36.35,8.81 | v36.35,8.81 36.35,10.31 v37.45,11.41 | v36.35,8.81 36.85,8.81 v39.2,6.46 39.2,5.31 v38.1,4.21 41,4.21 v41.1,4.11 42.2,5.21 v42.2,6.71 | v53.9,5.61 56,5.61 v56.75,4.86 | v63.3,11.41 65.1,13.21 v65.9,13.21 66.55,12.56 v66.55,11.46 | v66.4,14.81 66.45,14.81 v67.65,13.61 68.25,13.01 v70.1,13.01 | v78.8,12.76 78.8,10.56 v78.65,10.41 | v77.7,8.76 77.05,8.11 76.75,8.11 74.65,6.01 v70.95,6.01 70.35,5.41 v70.35,4.06 73.9,4.06 v74.25,3.71 | v68.6,5.36 68.58,5.38 | 68.58,5.38 68.08,5.88 68.08,7.43 v67.15,8.36 | v53.95,20.01 54.05,20.11 v54.05,23.91 | 68.58,5.38 v67.1,3.91 67,3.81 v64.2,3.81 61.8,3.81 v61.65,3.96 | v64.4,7.81 64.4,9.11 v64.9,9.61 | v57.65,32.66 56.35,32.66 55.9,33.11 55.9,34.51 v55.3,35.11 55.3,36.11 53.45,37.96 v47.8,37.96 | v11.6,124.81 10.9,124.11 v9.5,124.11 | v7.2,124.76 3.25,124.76 v2.7,125.31 2.7,120.26 v2.55,120.11 | v16.65,62.36 16.65,63.26 v15.55,64.36 | v16.8,66.36 16.8,68.11 v16.55,68.36 | v18.6,69.06 20.7,71.16 v22.6,71.16 | v12.25,58.01 14.3,60.06 v16,60.06 17.75,58.31 v18,58.31 18,55.61 v15.4,53.01 14.85,52.46 v14.85,49.41 | 13.75,35.06 13.75,35.21 15,36.46 v15,39.16 | v14.95,42.56 v14.95,46.46
  Bottom 0.152: v12.8,42.76 v12.8,44.56 | v10.9,45.71 10.9,48.51 7.8,51.61 v7.8,52.71 5.9,50.81 v5.9,49.21 5.3,48.61 5.3,45.71 v5.65,45.36 | v7.75,54.91 7.75,56.51 10,58.76 v10,59.56 | v49.5,125.81 49.5,126.61 v51.1,128.21 | v55.1,128.21 55.1,129.96 v56.35,131.21 | v74.45,131.01 73.1,129.66 v71.55,129.66 | v41.4,131.06 35.15,131.06 v35,131.21 | v10,85.71 9.2,84.91 v6.4,84.91 v6.4,82.91 | v72.55,33.56 72.05,34.06 v72.05,36.16 | v73.45,38.66 74.05,38.66 v74.8,37.91 | v76.1,39.61 78.2,39.61 v78.45,39.36 78.45,38.81 v77.35,37.71 | v2.96,39.61 4.06,40.71 v4.8,40.71
  pour Top (rank 6): -15.1,135.51 85.2,135.51 85.2,-9.09 -15.1,-9.09
  pour Bottom (rank 6): -17.2,136.61 87.1,136.61 87.1,-11.39 -17.2,-11.39
GPIO2/SDA1  (via drill 0.35)
  Top 0.152: v21.2,24.91 21.7,24.91 v23.3,23.31 | IC2.24:SDA 15.45,76.66 v14.5,75.71 | I2C.5 12.28,41.73 9.75,44.26 9.75,48.26 6.7,51.31 6.7,55.51 8.7,57.51 9.9,57.51 14.5,62.11 v14.5,67.51
  Bottom 0.152: v21.2,24.91 20.17,25.94 14.28,25.94 I2C1.5 14.3,25.96 14.3,29.66 R23.1 14.25,31.26 10.9,34.61 10.9,37.76 I2C.5 | v23.3,23.31 23.8,23.31 26.94,26.45 U$32.3 | IC1.4 14.22,75.98 v14.5,75.71 v14.5,67.51
GPIO3/SCL1  (via drill 0.35)
  Top 0.152: IC2.23:SCL 13.8,77.31 v12.7,78.41 | I2C1.4 8.2,21.38 8.2,19.31 12,15.51 v13.8,15.51 | v20.9,16.11 22.8,16.11 v23,15.91
  Bottom 0.152: I2C1.4 6.29,22.92 4.15,25.06 R22.1 4.15,36.76 5.51,38.12 9.6,38.12 | 9.6,38.12 I2C.4 | IC1.3 14.88,78.73 14.6,79.01 12.9,79.01 12.7,78.81 v12.7,78.41 12.7,75.21 13.7,74.21 13.7,69.81 13.5,69.61 13.5,65.81 10.1,62.41 4.9,62.41 2.8,60.31 2.8,43.91 7.5,39.21 8.51,39.21 9.6,38.12 | v13.8,15.51 14.6,14.71 19.5,14.71 v20.9,16.11 | U$32.5 23,21.13 v23,15.91
GPIO4/AUDIO_MCLK  (via drill 0.35)
  Top 0.152: v24.6,39.16 22.75,37.31 v22.7,37.31 | v21.2,33.71 21.2,33.11 22.5,31.81 32.6,31.81 33.3,31.11 33.3,28.71 32.2,27.61 U$32.7
  Bottom 0.152: v24.6,39.16 28.26,39.16 29.66,40.55 29.66,91.84 29.4,92.09 29.4,110.61 30.5,111.71 72.17,111.71 73.41,112.94 73.41,116.9 71.6,118.71 51.1,118.71 47.08,122.73 GPIO4.5 | v22.7,37.31 22.2,36.81 22.2,34.71 v21.2,33.71
GPIO5/CAM_AF_EN
  Bottom 0.152: U$32.29 59.7,27.61 58.6,28.71 58.6,34.11 53.9,38.81 33.95,38.81 30.8,41.96 30.8,109.41 32.3,110.91 72.7,110.91 74,112.21 74,118.81 72.8,120.01 60.6,120.01 57.88,122.73 GPIO5,6.5
GPIO6/GPIO_PZ0
  Bottom 0.152: U$32.31 62.2,27.61 61.3,28.51 61.3,31.81 64,34.51 64,36.01 63.4,36.61 61.5,36.61 58.7,39.41 34.9,39.41 32.1,42.21 32.1,108.41 33.7,110.01 73.1,110.01 74.5,111.41 74.5,119.81 73.5,120.81 62.9,120.81 58.44,125.27 GPIO5,6.6
GPIO8/SPI1_CS0
  Top 0.152: SPI1-0.5 15,54.64 16.9,52.74 16.9,45.61 17.7,44.81 17.7,38.26 23.05,32.91 51.58,32.91 52.34,32.15 U$32.24
GPIO9/SPI1_MISO  (via drill 0.35)
  Top 0.152: SPI1-0.4 11.1,52.26 11.1,48.71 15,44.81 16,44.81 v16.7,44.11
  Bottom 0.152: v16.7,44.11 16.7,41.61 19.25,39.06 23.35,39.06 24.3,38.11 45.7,38.11 48.5,35.31 48.5,28.91 U$32.21
GPIO10/SPI1_MOSI
  Top 0.152: SPI1-0.6 10.79,56.71 17.93,56.71 20.73,53.91 FULLCOLORLED.1
  Bottom 0.152: FULLCOLORLED.1 22.18,53.46 18.05,53.46 15.9,51.31 15.9,41.36 18.95,38.31 23,38.31 24.95,36.36 24.95,33.96 25.6,33.31 34.9,33.31 36.2,32.01 45.1,32.01 46,31.11 46,28.87 U$32.19
GPIO11/SPI1_SCLK  (via drill 0.35)
  Top 0.152: SPI1-0.2 10.14,51.18 10.14,48.73 16.9,41.97 v16.9,39.11 | v52,21.81 51.7,21.51 22.9,21.51 16.75,27.66 16.75,33.56 v16.8,33.61 | U$32.23 52.34,24.65 v52.2,24.51
  Bottom 0.152: v52,21.81 52,24.31 v52.2,24.51 | v16.8,33.61 16.8,39.01 v16.9,39.11
GPIO12/LCD_BL_PWM
  Bottom 0.152: JETSON_PWM.5 76.38,122.73 80.4,118.71 80.4,112.91 76.3,108.81 34.8,108.81 33.71,107.71 33.71,42 35.65,40.06 68.2,40.06 69.45,38.81 69.45,36.16 65.5,32.21 64.1,32.21 62.5,30.61 U$32.32
GPIO13/GPIO_PE6  (via drill 0.35)
  Top 0.152: JETSON_PWM.6 71.74,125.27 76.3,120.71 79.2,120.71 80.6,119.31 80.6,112.61 76.7,108.71 35,108.71 34.3,108.01 34.3,41.36 35.15,40.51 68.5,40.51 70.4,38.61 v70.4,37.11
  Bottom 0.152: v70.4,37.11 70.4,35.86 66.3,31.76 66.3,28.61 65.3,27.61 U$32.33
GPIO14/TXD  (via drill 0.35)
  Top 0.152: v30,24.81 30.7,25.51 30.7,29.01 31.84,30.15 U$32.8
  Bottom 0.152: v30,24.81 27.9,24.81 25.17,22.08 25.17,11.19 UART2.5
GPIO15/RXD
  Bottom 0.152: U$32.10 34.56,30.25 32.2,32.61 23.7,32.61 21.9,30.81 21.9,10.8 24.15,8.55 UART2.6
GPIO16/UART2_CTS
  Bottom 0.152: U$32.36 67.58,31.19 arc-90 69,32.61 78.75,32.61 arc-90 80.3,31.06 80.3,4.91 77.6,2.21 32.3,2.21 28.33,6.18 UART2.2
GPIO17/UART2_RTS
  Bottom 0.152: U$32.11 33.1,23.61 33.1,12.11 30.8,9.81 26.85,9.81 26.29,9.25 UART2.4
GPIO18  (via drill 0.35)
  Top 0.152: v49.45,32.06 49.2,32.31 38,32.31 arc90 37.1,31.41 U$32.12 | R39.2 arc-90 76.8,25.96 78.7,25.96 arc90 79.9,27.16 79.9,30.46 arc90 79.4,30.96 79.15,30.96 arc-90 78.5,31.61 arc90 77.55,32.56 75.8,32.56 arc-90 75,33.36 75,33.51 arc90 74.05,34.46 71.75,34.46 arc90 70.15,32.86 arc-90 69.05,31.76 v53.5,31.76
  Bottom 0.152: v53.5,31.76 53.2,32.06 v49.45,32.06
GPIO18/I2S0_SCLK  (via drill 0.35)
  Top 0.152: U$13.16 73.25,23.36 73.45,23.56 75.35,23.56 v76.65,22.26 76.6,22.31 R39.1
  Bottom 0.152: I2S0(DAP4)1.4 71.29,7.92 72.15,7.06 74.65,7.06 77.1,9.51 77.1,21.81 v76.65,22.26
GPIO19
  Bottom 0.152: U$32.35 67.6,27.61 68.8,28.81 68.8,31.41 arc-90 69.3,31.91 78.35,31.91 arc-90 79.6,30.66 79.6,26.21 79.4,26.01 79.4,21.91 79.55,21.76 79.55,10.21 arc-90 78.73,9.39 arc-90 77.85,10.27 77.85,24.21 76.75,25.31 R38.1
GPIO19/I2S0_FS  (via drill 0.35)
  Top 0.152: U$13.14 74.25,22.36 v74.3,22.41
  Bottom 0.152: I2S0(DAP4)1.2 74.84,8.55 76.4,10.11 76.4,15.76 76,16.16 74.1,16.16 73.8,16.46 73.8,17.66 74.15,18.01 75.75,18.01 76.4,18.66 76.4,20.31 v74.3,22.41 74.25,22.46 74.55,22.76 R38.2
GPIO20
  Bottom 0.152: R5.2 69.2,21.41 71,21.41 72.2,22.61 72.2,26.01 71.4,26.81 71.4,28.87 U$32.38
GPIO20/I2S0_DIN  (via drill 0.35)
  Top 0.152: I2S0(DAP4)1.5 67.87,11.09 67.65,11.31 67.65,12.11 69.3,13.76 69.3,14.26 68.8,14.76 67.6,14.76 67.35,15.01 67.35,15.76 v67.4,15.81
  Bottom 0.152: R5.1 67.4,19.61 v67.4,15.81
GPIO21  (via drill 0.35)
  Top 0.152: U$32.40 71.3,31.51 v71.3,33.36 | v73.85,33.56 73.7,33.56 73.15,33.01 73.15,32.16 73.45,31.86 75.45,31.86 75.85,31.46 75.85,30.51 75.45,30.11 74.45,30.11 74,29.66 74,28.51 74.45,28.06 75.25,28.06 75.65,27.66 75.65,26.46 75.3,26.11 R10.2
  Bottom 0.152: v71.3,33.36 71.3,38.61 arc-90 73.4,40.71 77.75,40.71 arc-90 80.5,37.96 80.5,36.56 arc-90 79.4,35.46 77.35,35.46 arc-90 75.7,37.11 75.7,37.96 arc90 74.05,39.61 arc90 72.45,38.01 72.45,37.21 arc90 73.7,35.96 arc-90 74.35,35.31 74.35,34.06 arc-90 v73.85,33.56
GPIO21/I2S0_DOUT
  Top 0.152: U$13.1 71.65,24.76 71.8,24.91 73.15,24.91 73.72,24.33 | 73.7,24.31 73.72,24.33 | 73.72,24.33 R10.1
GPIO23/SPI2_CS1  (via drill 0.35)
  Top 0.152: v43.5,24.71 43.5,28.83 U$32.16
  Bottom 0.152: SPI2-1.5 52.22,11.09 43.5,19.81 v43.5,24.71
GPIO24/SPI2_CS0  (via drill 0.35)
  Top 0.152: v40.9,25.41 40.9,31.21 41.4,31.71 43.8,31.71 44.72,30.79 U$32.18
  Bottom 0.152: SPI2-0.5 40.27,24.78 v40.9,25.41
GPIO25/SPI2_MISO  (via drill 0.35)
  Top 0.152: 56.39,6 56.35,5.96 | 56.35,5.96 54.7,4.31 42.9,4.31 41.29,5.92 SPI2-0.4 | v45.5,24.31 47.7,24.31 48.5,25.11 48.5,28.85 U$32.22 | 56.35,5.96 56.35,8.49 SPI2-1.4
  Bottom 0.152: v45.5,24.31 45.4,24.31 44,25.71 43.1,25.71 42.6,25.21 42.6,18.71 47.3,14.01 47.3,12.91 53.4,6.81 55.2,6.81 56.29,7.9 SPI2-1.4
GPIO26/SPI2_MOSI  (via drill 0.35)
  Top 0.152: SPI2-0.6 39.25,8.76 40.3,9.81 53.09,9.81 54.25,8.65 SPI2-1.6 | v57.5,19.41 57.5,17.71 61.5,13.71 61.5,10.31 v61.4,10.21 | v56.8,24.61 58.2,26.01 65.6,26.01 66.3,26.71 66.3,28.51 66.7,28.91 68.82,28.91 U$32.37
  Bottom 0.152: v56.8,24.61 56.8,20.11 v57.5,19.41 | v61.4,10.21 61,9.81 55.4,9.81 54.25,8.66 SPI2-1.6
GPIO27/SPI2_SCK
  Bottom 0.152: U$32.13 40,27.61 41.8,25.81 41.8,17.91 46.1,13.61 46.1,9.51 45.3,8.71 43.49,8.71 SPI2-0.2 43.33,5.68 45.5,3.51 56.9,3.51 58.43,5.04 58.43,8.45 SPI2-1.2
IR_OUT  (via drill 0.35)
  Top 0.152: U$19.64:P000 27.86,101.66 v28.26,102.05
  Bottom 0.152: v28.26,102.05 28.7,102.49 28.7,110.41 26.7,112.41 25.4,112.41 24.6,113.21 24.6,115.61 25.4,116.41 30.6,116.41 32.7,118.51 32.7,124.81 34.2,126.31 34.2,128.71 31.8,131.11 22.44,131.11 M2.1:OUT
IR_TRANSFER  (via drill 0.35)
  Top 0.152: R13.1 15.4,106.01 v15.4,104.51 | v21.3,94.21 21.35,94.16 U$19.42:P106
  Bottom 0.152: v15.4,104.51 18.2,101.71 18.2,97.31 v21.3,94.21
JETSON3V3  (via drill 0.35)
  Top 0.152: R6.1 67.4,25.21 v66.2,25.21 | R17.1 63.5,17.31 U$14.3 | v12.8,28.51 14.4,28.51 22.6,20.31 v26.5,20.31 | v28.1,24.01 26.5,25.61 25.1,25.61 24.4,26.31 U$32.1 | v5.6,35.91 4.1,37.41 4.1,59.81 4.2,59.91 | 4.2,59.91 v4.3,59.91 | v33.2,25.51 37.2,25.51 39.1,23.61 43.6,23.61 44.72,24.73 U$32.17 | 18,75.91 IC2.25:VDD 16.55,76.01 C15.2 16.15,75.61 15.5,75.61 15.2,75.31 15.2,74.91 14.45,74.16 R8.2 12.7,72.41 v12.6,72.31 | v4.4,63.41 4.4,60.11 4.2,59.91
  Bottom 0.152: U$14.3 53.3,17.71 44.72,26.29 U$32.17 44.72,27.51 46.72,25.51 65.9,25.51 v66.2,25.21 | v12.8,28.51 12.65,28.66 R23.2 10.6,31.76 10.6,32.61 9.4,33.81 R22.2 5.75,35.76 v5.6,35.91 | v26.5,20.31 28.1,21.91 v28.1,24.01 28.8,23.31 30.8,23.31 | 15.5,77.63 IC1.2 15.53,66.33 10.4,61.21 5.6,61.21 v4.3,59.91 | 30.8,23.31 30.9,23.31 | 30.8,23.31 33,25.51 v33.2,25.51 | v12.6,72.31 12.6,71.39 13.06,70.94 13.06,66.86 9.6,63.41 v4.4,63.41
JETSON5V
  pour Top (no thermals): 22.25,34.56 22.25,35.01 24,36.76 30.75,36.76 31,36.51 32,36.51 32.1,36.41 32.4,36.41 33.4,35.41 34.55,35.41 35,35.86 36.4,35.86 36.55,35.71 36.55,35.06 36.4,34.91 36.4,34.11 36.7,33.81 39.8,33.81 41.8,35.81 44.05,35.81 44.3,35.56 44.3,33.96 44.55,33.71 48.1,33.71 48.8,34.41 48.8,35.16 49.1,35.46 50.65,35.46 50.95,35.76 52.15,35.76 52.35,35.56 52.35,33.96 52.85,33.46 55.9,33.46 56.65,34.21 56.65,35.11 57.05,35.51 58.65,35.51 59.1,35.96 60.1,35.96 60.4,35.66 60.4,33.91 60.65,33.66 63.65,33.66 65.9,35.91 68.15,35.91 68.6,35.46 68.6,35.21 66.5,33.11 60.45,33.11 59.8,33.76 57.65,33.76 56.5,32.61 52.4,32.61 51.6,33.41 23.4,33.41
JETSON　5V  (via drill 0.35)
  Top 0.152: U$13.8 68.1,21.86 C6.2 | U$13.7 68.4,22.36 C6.2 | C6.2 C8.2 | 42.2,12.81 43,13.61 56,13.61 57.31,12.3 SPI2-1.3 | 42.2,12.81 42.2,11.2 SPI2-0.3 | 27.21,13.11 27.21,13.22 28.1,14.11 40.9,14.11 42.2,12.81 | 27.21,13.11 21.01,19.31 CN3.1 18.9,17.71 11.7,17.71 11,18.41 11,21.01 11.89,21.9 I2C1.3 11,23.18 11,30.31 14.6,33.91 14.6,35.51 14.1,36.01 | D1.2 16.48,82.93 16.5,82.91 | A1.ANODE 9.7,81.21 9.45,80.96 9.45,74.03 D3.ANODE 10.18,71.13 11.4,69.91 11.4,65.11 10.1,63.81 7,63.81 5.5,62.31 5.5,51.51 9,48.01 9,43.36 11,41.36 11,38.38 I2C.3 13.01,37.1 14.1,36.01 | 20.8,85.01 20.57,84.78 R21.2 | C5.2 66.75,35.36 LED4.1-VDD 64.7,33.31 60.4,33.31 59.8,33.91 59.8,35.26 C1.2 58.75,35.36 LED3.1-VDD 56.4,33.01 52.9,33.01 51.7,34.21 C2.2 50.9,34.56 LED2.1-VDD 48.8,33.41 44.2,33.41 43.7,33.91 C3.2 42.75,35.36 LED1.1-VDD 41.15,34.56 40.2,33.61 36.5,33.61 35.7,34.41 C4.2 34.9,34.56 LED0.1-VDD 33.9,34.51 32.15,36.26 28,36.26 U$28.5 27.2,35.71 26.36,36.55 24.59,36.55 23.9,35.86 23.9,34.31 v23.6,34.01 23.6,34.46 v23.05,35.01 23.35,35.01 v23.85,35.51 | U$32.2 24.3,30.15 23.54,30.91 22,30.91 v21.2,31.71 21.05,31.71 v20.05,32.71 20,32.71 v18.95,33.76 16.75,35.96 16.75,36.01 14.1,36.01 | 27.21,13.11 27.21,11.19 UART2.3
  Top 0.203: I2S0(DAP4)1.3 72.31,10.87 71.35,9.91 66.5,9.91 58.6,17.81 58.6,20.51 56.1,23.01 | C8.2 66.1,21.96 64.8,23.26 61.25,23.26 60.95,23.56 58.4,23.56 57.85,23.01 56.1,23.01 | 56.1,23.01 56,23.11
  Top 0.254: D1.2 19.95,83.01 20.57,83.63 20.57,84.78 | R21.2 20.7,84.91 22.35,84.91 22.6,85.16 29.55,85.16 33.2,88.81 33.2,108.21 34.95,109.96 71.45,109.96 73.95,112.46 73.95,117.71 70.85,120.81 68.65,120.81 67.69,121.77 JETSON_PWM.3 67.69,122.15 65.9,120.36 53.15,120.36 52.69,120.82 52.69,122.66 | 52.69,122.66 GPIO5,6.3 | GPIO4.3 37.59,121.27 38.4,120.46 50.49,120.46 52.69,122.66
  Top 0.508: U$32.2 24.04,30.15 22.4,28.51 22.4,25.86 25.65,22.61 55.7,22.61 56.1,23.01
  Top 0.813: A1.ANODE 15.35,81.21 16.5,82.36 16.5,82.91
  Bottom 0.152: SPI1-0.3 13.36,52.6 13.85,52.11 13.85,38.31 12.64,37.1 I2C.3 | v23.6,34.01 21.3,31.71 v21.2,31.71
  pour Top (no thermals): 22.65,29.11 24.75,29.11 25.3,29.66 25.3,30.76 24.85,31.21 23.7,31.21 23.5,31.41 22.4,31.41 15.95,37.86 11.8,37.86 11.3,38.36 11.3,41.81 9.45,43.66 9.45,48.11 5.85,51.71 5.85,61.86 7.25,63.26 10.4,63.26 12.25,65.11 12.25,68.21 11.95,68.51 11.95,69.81 11.7,70.06 11.7,70.41 11.05,71.06 11.05,75.61 10.2,76.46 10.2,78.96 10.45,79.21 10.45,79.66 11.7,80.91 11.7,81.56 9.85,83.41 8.6,83.41 7.6,82.41 7.6,76.56 8.85,75.31 8.85,71.91 11.1,69.66 11.1,66.11 9.55,64.56 7,64.56 5.25,62.81 5.25,51.41 8.75,47.91 8.75,43.41 10.85,41.31 10.85,37.36 11.8,36.41 13,36.41 14.1,35.31 14.1,35.26 9.95,31.11 9.95,26.81 10.9,25.86 10.9,22.06 11.85,21.11 12.95,21.11 13.1,21.26 13.1,22.26 12.65,22.71 11.85,22.71 11.15,23.41 11.15,29.81 15.75,34.41 17.2,34.41 21.95,29.66 21.95,28.96 22,28.91 22.45,28.91
  pour Top: 10.75,18.36 10.75,21.56 11.85,22.66 12.6,22.66 13.05,22.21 13.05,21.61 12.55,21.11 11.6,21.11 11.3,20.81 11.3,19.06 12.3,18.06 18.25,18.06 20.55,20.36 21.3,20.36 26.75,14.91 55.95,14.91 58.1,12.76 58.1,10.76 57.6,10.26 56.95,10.26 56.5,10.71 56.5,11.76 55.6,12.66 43.7,12.66 43.15,12.11 43.15,10.76 42.65,10.26 42,10.26 41.45,10.81 41.45,12.06 40.4,13.11 28.65,13.11 28.2,12.66 28.2,10.91 27.65,10.36 27.05,10.36 26.5,10.91 26.5,11.91 23.7,14.71 23.7,16.06 22.25,17.51 11.6,17.51
LED1(D8)  (via drill 0.35)
  Top 0.152: R11.1 21.7,84.11 v21.7,84.01 | v18.6,87.41 17.6,88.41 10.1,88.41 9.9,88.61 9.9,91.91 11.4,93.41 12.2,93.41 12.45,93.66 12.45,95.26 13.35,96.16 U$19.28:P304
  Bottom 0.152: v21.7,84.01 18.6,87.11 v18.6,87.41
LED2(D9)  (via drill 0.35)
  Top 0.152: U$19.29:P303 13.75,95.66 12.95,94.86 12.95,92.46 v12.7,92.21 | v12.3,86.71 14.9,84.11 v17.5,84.11 | v18.6,80.31 21.6,80.31 R12.1
  Bottom 0.152: v12.7,92.21 12.3,91.81 v12.3,86.71 | v17.5,84.11 17.9,83.71 17.9,81.01 v18.6,80.31
MONO
  Top 0.152: U$13.4 70.15,24.66 R6.2
N$1  (via drill 0.35)
  Top 0.152: LED0.2-DOUT 33.2,37.11 v33.2,36.61 | v37.5,36.21 37.5,34.61 LED1.4-DIN
  Bottom 0.152: v33.2,36.61 37.1,36.61 v37.5,36.21
N$2
  Top 0.152: R1.1 LED6.A
N$3
  Top 0.152: LED8.A 76.2,34.54 R3.1
N$4
  Top 0.152: LED9.A 78.7,126.21 R4.1
N$5
  Top 0.152: R21.1 18.9,86.11 LED5.ANODE
N$6  (via drill 0.35)
  Top 0.152: LED1.2-DOUT 41.4,37.31 v40.6,37.31 | v45.5,36.21 45.5,34.61 LED2.4-DIN
  Bottom 0.152: v40.6,37.31 40.6,36.61 40.7,36.51 45.2,36.51 v45.5,36.21
N$7
  Top 0.152: R7.1 20.3,70.11 21.1,70.91 IC2.4:LED1
N$8  (via drill 0.35)
  Top 0.152: LED2.2-DOUT 49.95,37.46 v49.2,36.71 | v52.9,36.11 53.45,35.56 LED3.4-DIN
  Bottom 0.152: v49.2,36.71 49.8,36.11 v52.9,36.11
N$9  (via drill 0.35)
  Top 0.152: LED3.2-DOUT 57.95,37.06 v57.6,36.71 | v61,35.91 61.45,35.46 LED4.4-DIN
  Bottom 0.152: v57.6,36.71 58.3,36.01 60.9,36.01 v61,35.91
N$10
  Top 0.152: R7.2 20,70.91 20.45,71.36 IC2.3:LED0
N$11  (via drill 0.35)
  Top 0.152: M1.D v13.85,111.91 13.85,117.16 13.2,117.81 5.5,117.81 3.9,119.41 3.9,121.61 4.97,122.68 LED7.K 5.13,123.95 LED6.K 5.13,130.04 7.47,132.38 76.9,132.38 LED9.K | LED8.K 79.17,32.84 80.4,31.61 80.4,1.91 79.3,0.81 6.8,0.81 4.8,2.81 4.8,16.91 2.2,19.51 v2.2,99.01
  Bottom 0.152: v2.2,99.01 2.2,100.81 3.7,102.31 9.1,102.31 10.8,104.01 10.8,105.01 9.1,106.71 9.1,109.81 11.2,111.91 v13.85,111.91
N$12  (via drill 0.35)
  Top 0.152: R7.7 v12.3,70.91
  Bottom 0.152: 0/ST.I/O 10.54,70.91 v12.3,70.91
N$13  (via drill 0.35)
  Top 0.152: R7.8 12.9,69.01 v12.5,69.01
  Bottom 0.152: v12.5,69.01 10,66.51 1/TH.I/O
N$14
  Top 0.152: M1.G 16.15,108.16 16.2,108.11 R13.2 R14.1
N$15  (via drill 0.35)
  Top 0.152: R9.1 27.25,34.56 LED0.4-DIN 30.1,35.21 v30.8,35.21 | R45.1 31.3,38.81 v31.3,37.21
  Bottom 0.152: v30.8,35.21 31.3,35.71 v31.3,37.21
N$16
  Top 0.152: R2.1 6.43,120.11 LED7.A
N$17
  Top 0.152: R9.2 25.55,34.56 U$28.4
N$18
  Top 0.152: U$19.9:P213/XTAL 20.35,104.56 20.6,104.81 21,104.81 21.7,105.51 RS.1:INPUT 22.1,106.91 C9.2
N$19
  Top 0.152: C10.2 28.48,103.38 28.52,103.43 | 28.52,103.43 29.2,102.76 29.2,101.91 28.35,101.06 28.35,99.41 28.1,99.16 U$19.59:P010/VREFH0 | FB1.2 29.4,104.31 28.52,103.43
N$20
  Top 0.152: U$19.56:AVCC0 28.05,97.66 28.85,98.46 28.85,100.36 29.75,101.26 29.75,102.56 30.48,103.28 30.62,103.28 | C7.2 30.7,103.81 | C7.2 30.62,103.28 | 30.62,103.28 30.55,103.21 | C7.2 30.7,104.51 FB2.2
N$21
  Top 0.152: U$19.10:P212/EXTAL 19.85,105.26 19.3,105.81 RS.3:OUTPUT 19.3,107.61 18.25,108.66 C20.2
N$22
  Top 0.152: U$19.5:VCL 22.35,105.51 C11.2
N$23
  Top 0.152: R16.2 11.8,95.51 12.95,96.66 U$19.27:P200
N$24
  Top 0.152: U$19.26:P201/MD 11.95,97.16 R19.2
N$25
  Bottom 0.152: R25.1 R24.2
N$26  (via drill 0.35)
  Top 0.152: U$19.16:P407 16.85,105.26 v16.9,105.31
  Bottom 0.152: R24.1 16.4,105.81 v16.9,105.31 16.9,104.81 R20.2
N$27
  Top 1.27: D3.CATHODE 6.4,72.43 0/ST.VCC 1/TH.VCC
N$28
  Top 0.152: U$19.49:P500 27.75,94.16 27.9,94.01 27.9,93.41 27.5,93.01 26.5,93.01 26.2,92.71 R27.1 R26.2
N$29
  Top 0.152: JP3.1 13.5,92.71 13.5,94.26 13.9,94.66 U$19.31:P301
N$30
  Top 0.152: R30.1 4.9,104.31 5.8,105.21 5.8,107.01 7.05,108.26 U$22.B5:CC2
N$31
  Top 0.152: R31.1 5.3,115.61 5.9,115.01 5.9,112.41 7.05,111.26 U$22.A5:CC1
N$32
  Top 0.152: LED10.CATHODE R32.1
N$33
  Top 0.152: U$19.36:P111 18.35,91.16 16.9,89.71 13.5,89.71 12.4,90.81 LED10.ANODE
N$34
  Top 0.152: R34.2 29.45,96.66 U$19.54:P013/VREFL
N$35
  Top 0.152: R33.2 28.75,97.16 U$19.55:P012/VREFH
N$36
  Top 0.152: LED11.CATHODE 31.1,99.61 31.1,98.31 R33.1
N$37
  Top 0.152: R34.1 LED12.CATHODE
N$38
  Bottom 0.152: IC1.7 15.53,82.03 15.6,82.11 16.3,82.11 | 16.3,82.11 16.9,82.11 R35.2 | IC1.8 16.18,81.98 16.3,82.11
N$39
  Top 0.152: M2.3:VCC 16.6,130.07 R43.2 16.9,128.11 C22.2 C21.2
N$40  (via drill 0.35)
  Top 0.152: JP4.1 10.7,93.71 v10.7,93.76 | v16.85,96.11 15.9,95.16 U$19.30:P302
  Bottom 0.152: v10.7,93.76 14.5,93.76 v16.85,96.11
N$41
  Top 0.152: FULLCOLORLED.2 26.17,53.91 28.5,51.58 R45.2 arc-90 27.85,39.36 27.65,39.36 arc90 26.5,38.21 U$28.2
N$43
  Top 0.152: RAD9.K 20.55,65.33 20.55,59.46 22.8,57.21 25.4,57.21 27.6,59.41 27.6,79.06 24.95,81.71 R12.2
N$44  (via drill 0.35)
  Top 0.152: v25.55,83.06 25.55,83.16 R11.2
  Bottom 0.152: RAD8.K 22.53,58.68 23.8,57.41 25.5,57.41 27.6,59.51 27.6,79.31 25.55,81.36 v25.55,83.06
OUTN
  Top 0.152: U$13.10 70.65,20.06 L2.1
OUTP
  Top 0.152: U$13.9 70.15,20.06 L1.1
RA4_SCL_5V  (via drill 0.35)
  Top 0.152: v24.5,89.21 24.5,92.01 U$19.48:P100
  Bottom 0.152: IC1.6 14.88,82.68 15.1,82.91 16.2,82.91 16.4,83.11 R36.2 16.4,86.71 18.6,88.91 24.2,88.91 v24.5,89.21
RA4_SDA_5V  (via drill 0.35)
  Top 0.152: 23.8,92.11 U$19.47:P101 23.85,90.56 v23.4,90.11
  Bottom 0.152: IC1.5 14.22,82.68 13.2,83.71 R37.2 13.2,87.91 15,89.71 23,89.71 v23.4,90.11
RESET  (via drill 0.35)
  Top 0.152: SW1.1 SW1.2 | SW1.1 6.9,97.11 | SW1.1 7.08,97.63 | 7.08,97.63 7.1,97.66 | v16.7,97.61 16.65,97.66 U$19.25:RES 14.8,97.71 13.3,97.71 13.2,97.81 9.2,97.81 R28.2 7.5,97.21 7.08,97.63 | v24.6,108.71 24.6,110.66 C16.2 | v31.6,122.31 31.6,123.71 31.1,124.21 29.2,124.21 CN6.10
  Bottom 0.152: v16.7,97.61 18.7,95.61 18.7,93.71 20.1,92.31 22.2,92.31 24.9,95.01 24.9,108.41 v24.6,108.71 24.6,111.41 23.9,112.11 23.9,116.11 24.9,117.11 29.4,117.11 31.6,119.31 v31.6,122.31
SCII_RXD  (via drill 0.35)
  Top 0.152: CN6.7 27.8,118.31 26.7,117.21 24.4,117.21 23.6,116.41 23.6,113.61 26.4,110.81 v26.4,105.91 | v28.4,95.71 28.4,95.61 27.9,95.11 26.4,95.11 U$19.51:P502
  Bottom 0.152: v26.4,105.91 27.4,104.91 27.4,96.71 v28.4,95.71
SCII_TXD  (via drill 0.35)
  Top 0.152: CN6.8 27.8,125.71 28.6,126.51 29.7,126.51 v30.3,125.91 | v23.2,96.21 24.75,94.66 U$19.50:P501
  Bottom 0.152: v30.3,125.91 30.5,125.71 30.5,120.31 28.2,118.01 24.5,118.01 23.2,116.71 v23.2,96.21
SHILED  (via drill 0.35)
  Top 0.152: U$22.SHILED2 8.1,105.66 8.1,104.41 R29.1 | v2.2,111.51 2,111.31 2,100.51 3,99.51 7.4,99.51 v8.9,101.01 8.55,101.36 C17.2 8.55,103.96 R29.1 | 8.85,103.66 R29.1 | v11.4,101.31 11.4,102.76 U$23.1
  Bottom 0.152: U$22.SHILED6 3.95,113.26 v2.2,111.51 | v8.9,101.01 11.1,101.01 v11.4,101.31
SP_MINUS
  Top 0.152: L2.2 71.2,17.43 U$12.1 71.42,16.48 73,14.91 75.05,14.91 79.6,10.36 79.6,2.71 78.5,1.61 9,1.61 7.7,2.91 7.7,4.51 T4.P$2
  Top 1.27: T4.P$1 7.7,4.51
  Bottom 0.152: T4.P$1 3.19,7.71 CN5.1
SP_PLUS
  Top 0.152: L1.2 69.6,17.43 U$11.1 69.38,16.03 72.1,13.31 74.9,13.31 76.6,11.61 76.6,8.31 71,2.71 14.79,2.71 13.22,4.28
  Top 1.27: T3.P$1 T3.P$2 13.22,4.28
  Bottom 0.152: CN4.1 6.1,7.61 11.1,7.61 12.9,5.81 T3.P$2
SWDCLK  (via drill 0.35)
  Top 0.152: CN6.4 25.4,125.81 v25.1,126.11 | v19.6,97.81 16.8,95.01 16.8,94.61 16.3,94.11 14.9,94.11 U$19.32:P300/TCK/SWCLK
  Bottom 0.152: v25.1,126.11 22,126.11 20.2,124.31 20.2,117.51 20.8,116.91 20.8,115.41 21.6,114.61 21.6,99.81 v19.6,97.81
SWDIO  (via drill 0.35)
  Top 0.152: CN6.2 22.5,124.01 21.5,123.01 21.5,115.91 v21.8,115.61 | v20.8,96.91 18.8,94.91 18.1,94.91 16.83,93.64 16.83,92.17 U$19.33:P108/TMS/SWDIO
  Bottom 0.152: v21.8,115.61 22.5,114.91 22.5,98.61 v20.8,96.91
USB_DN  (via drill 0.35)
  Top 0.152: U$19.18:P915/USB_DM 13.85,101.16 13.1,101.91 13.1,102.81 | 13.1,102.81 13.2,102.81 13.8,103.41 13.8,108.61 v13.4,109.01 | 13.1,102.81 U$23.2 | U$22.B7:DN2 11.45,110.76 v11.8,110.41 11.15,109.76 U$22.A7:DN1
  Bottom 0.152: v13.4,109.01 13.2,109.01 v11.8,110.41
USB_DP  (via drill 0.35)
  Top 0.152: U$19.19:P914/USB_DP 13.55,100.66 12.3,101.91 12.3,104.11 13,104.81 U$23.3 v13.05,107.56 | U$22.A6:DP1 7.65,110.26 7.5,110.11 7.5,109.41 7.65,109.26 U$22.B6:DP2 10.95,109.26 v11.3,108.91
  Bottom 0.152: v13.05,107.56 12.95,107.56 11.6,108.91 v11.3,108.91
USBLDO3V3  (via drill 0.35)
  Top 0.152: v17.3,99.91 17.06,100.16 U$19.20:VCC_USB
  Bottom 0.152: C18.2 16.11,101.11 v17.3,99.91
VBUS_5V2
  Top 0.152: 12,107.31 12,105.31 11.5,104.81 U$23.4 11.15,104.46 10,103.31 10,100.71 8.2,98.91 3.9,98.91 3,98.01 3,92.51 5.45,90.06 D24.2 | 12,107.31 12,109.11 13,110.11 13,110.91 11.5,112.41 U$22.A4,B9:VBUS | U$22.B4,A9:VBUS 11.7,107.61 12,107.31

## Text on the board
tPlace: IR | IRRC | SWD | IR | IR | #519 REV2.1.1 | RA_CAN_RX | RA_CAN_TX | IR | 1 | 1 | +
Document: USB RA4M1 | 38kHz IR | PCA9685 / SG-90 / RC Car | I 2C | I 2C | #519 Jetson Nano / Rev2.1.1 / 2024/02/02 | SERIAL | SPI2-0 | SPI2-1 | I2S-MIC | SPEAKER